# Altium schematic sheet H-bridge.SchDoc
size A4; SheetNumber: 1; SheetTotal: 2
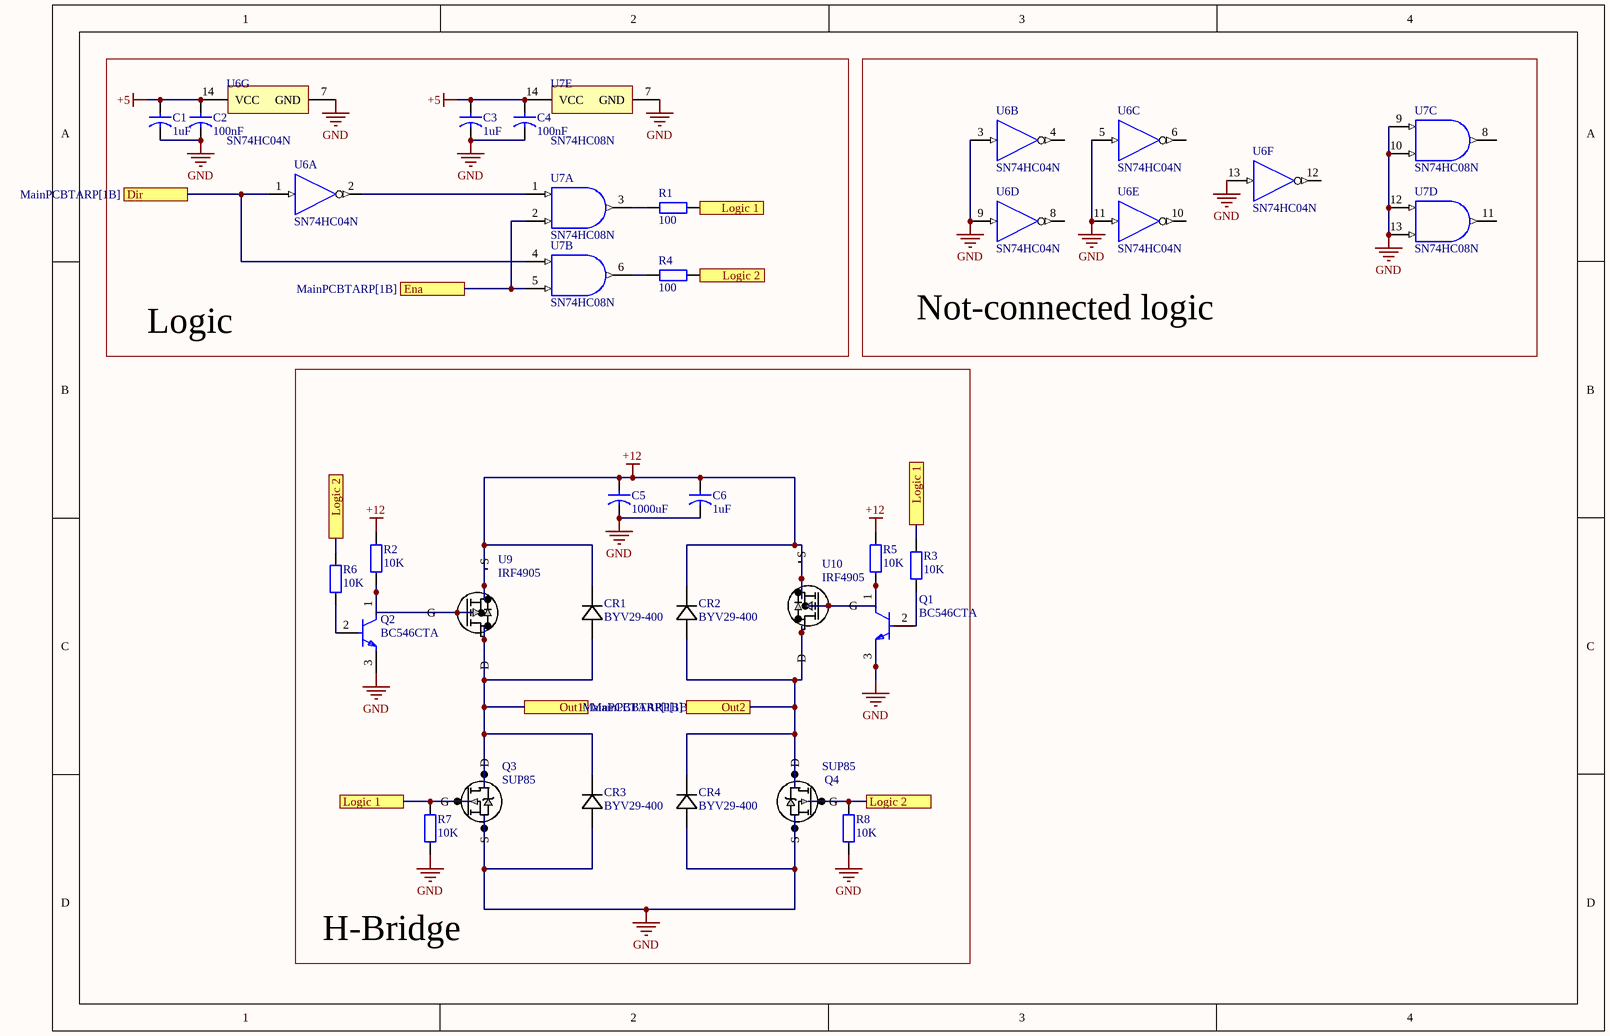
[diagram p0: H-bridge.SchDoc]

## Parts
C1  value 1uF  [Cap Lyt Ø8]  (hidden comment: Cap)
C2  value 100nF  [Cap Lyt Ø8]  (hidden comment: Cap)
C3  value 1uF  [Cap Lyt Ø8]  (hidden comment: Cap)
C4  value 100nF  [Cap Lyt Ø8]  (hidden comment: Cap)
C5  value 1000uF  [Cap Lyt Ø18]  (hidden comment: Cap)
C6  value 1uF  [Cap Lyt Ø8]  (hidden comment: Cap)
CR1  BYV29-400  [SOD59_WEN]
CR2  BYV29-400  [SOD59_WEN]
CR3  BYV29-400  [SOD59_WEN]
CR4  BYV29-400  [SOD59_WEN]
Q1  BC546CTA  [FP-135AR-MFG]
Q2  BC546CTA  [FP-135AR-MFG]
Q3  SUP85  [PG-TO251-3-901_INF]
Q4  SUP85  [PG-TO251-3-901_INF]
R1  value 100  [RES THT 9mm]  (hidden comment: Resistor)
R2  value 10K  [RES THT 9mm]  (hidden comment: Resistor)
R3  value 10K  [RES THT 9mm]  (hidden comment: Resistor)
R4  value 100  [RES THT 9mm]  (hidden comment: Resistor)
R5  value 10K  [RES THT 9mm]  (hidden comment: Resistor)
R6  value 10K  [RES THT 9mm]  (hidden comment: Resistor)
R7  value 10K  [RES THT 9mm]  (hidden comment: Resistor)
R8  value 10K  [RES THT 9mm]  (hidden comment: Resistor)
U6  SN74HC04N  [N0014A]  (parts A,B,C,D,E,F,G of 7)
U7  SN74HC08N  [N0014A]  (parts A,B,C,D,E of 5)
U9  IRF4905  [TO220AB_VIS]
U10  IRF4905  [TO220AB_VIS]

## Blocks framed on the sheet
Logic: C1-C4 R1 R4 U6 U7
Not-connected logic: U6 U7
H-Bridge: C5 C6 CR1-CR4 Q1-Q4 R2 R3 R5-R8 U9 U10

## Ports
Dir (see MainPCBTARP[1B]), Ena (see MainPCBTARP[1B]), Logic 1 (see H-bridge[1D], H-bridge[2A]), Logic 1 (see H-bridge[1D], H-bridge[3C]), Logic 1 (see H-bridge[2A], H-bridge[3C]), Logic 2 (see H-bridge[1C], H-bridge[2B]), Logic 2 (see H-bridge[1C], H-bridge[3D]), Logic 2 (see H-bridge[2B], H-bridge[3D]), Out1 (see MainPCBTARP[1B]), Out2 (see MainPCBTARP[1B])

## Nets
+5: C1.1 C2.1 C3.1 C4.1 U6.14(VCC) U7.14(VCC)
+12: C5.1 C6.1 CR1.1 CR2.1 R2.2 R5.2 U9.3(S) U10.3(S)
GND: C1.2(g) C2.2(g) C3.2(g) C4.2(g) C5.2(g) C6.2(g) CR3.2 CR4.2 Q1.3(E) Q2.3(E) Q3.3(S) Q4.3(S) R7.1 R8.1 U6.3(2A) U6.5(3A) U6.7(GND) U6.9(4A) U6.11(5A) U6.13(6A) U7.7(GND) U7.9(3A) U7.10(3B) U7.12(4A) U7.13(4B)
Dir: U6.1(1A) U7.4(2A) ; port Dir
Ena: U7.2(1B) U7.5(2B) ; port Ena
Logic 1: Q3.1(G) R1.1 R3.2 R7.2 ; port Logic 1
Logic 2: Q4.1(G) R4.2 R6.2 R8.2 ; port Logic 2
Out1: CR1.2 CR3.1 Q3.2(D) U9.2(D) ; port Out1
Out2: CR2.2 CR4.1 Q4.2(D) U10.2(D) ; port Out2
NetQ1_1: Q1.1(C) R5.1 U10.1(G)
NetQ1_2: Q1.2(B) R3.1
NetQ2_1: Q2.1(C) R2.1 U9.1(G)
NetQ2_2: Q2.2(B) R6.1
NetR1_2: R1.2 U7.3(1Y)
NetR4_1: R4.1 U7.6(2Y)
NetU6_2: U6.2(~{1Y}) U7.1(1A)

Not connected (* = marked no-connect by the designer): U6 4(~{2Y}) 6(~{3Y}) 8(~{4Y}) 10(~{5Y}) 12(~{6Y}); U7 8(3Y) 11(4Y)

## Library data of the parts
C1-C6 = Capacitor electrolytic
CR1-CR4 = BYV29-500: No Description Available; Manufacturer_Name: WeEN Semiconductors; Copyright: Copyright (C) 2025 Ultra Librarian. All rights reserved.; Manufacturer_Part_Number: BYV29-500
Q1 Q2 = CMP-00278-84408942-1: BC546CTA Small Signal Bipolar Transistor, 0.1A I(C), 65V V(BR)CEO, 1-Element, NPN, Silicon, TO-92; Manufacturer Lifecycle Status: ACTIVE; Gain Bandwidth Product: 300MHz; Emitter Base Voltage (VEBO): 6V; Element Configuration: Single; Max Power Dissipation: 500mW; Max Collector Current: 100mA; Number of Elements: 1; Collector Base Voltage (VCBO): 80V; Max Junction Temperature (Tj): 150°C; hFE Min: 110; Collector Emitter Saturation Voltage: 250mV; Lead Free: Lead Free; Max Breakdown Voltage: 65V; Collector Emitter Breakdown Voltage: 65V; Collector Emitter Voltage (VCEO): 65V; Voltage Rating (DC): 65V; Weight: 240mg; Polarity: NPN; Schedule B: 8541210080, 8541210080; Contact Plating: Tin; Lifecycle Status: Production; Mount: Through Hole; Length: 4.58mm; Number of Pins: 3; Current Rating: 100mA; Width: 3.86mm; Transition Frequency: 300MHz; Case/Package: TO-92-3; Frequency: 300MHz; Power Dissipation: 500mW; Max Operating Temperature: 150°C; Min Operating Temperature: -65°C; Max Frequency: 300MHz; Height: 4.58mm; Radiation Hardening: No; NexarPartId: 84408942; RoHS: Compliant
Q3 Q4 = IRLU024NPBF: The IR MOSFET family of power MOSFETs utilizes proven silicon processes offering designers a wide portfolio of devices to support various applications such as DC motors, inverters, SMPS, lighting, load switches as well as battery powered applications.The devices are available in a variety of surface mount and through-hole packages with industry standard footprints for ease of design.; Manufacturer_Name: Infineon; Copyright: Copyright (C) 2025 Ultra Librarian. All rights reserved.; Manufacturer_Part_Number: IRLU024NPBF; Datasheet: https://www.infineon.com/dgdl/irlr024npbf.pdf?fileId=5546d462533600a4015356694f7f265d
U6 = CMP-1615-00892-2: Hex Inverters, N0014A, TUBE; Manufacturer: Texas Instruments; VCC(Min)(V): 2; Bits(#): 6; Technology Family: HC; tpd @ Nom Voltage(Max)(ns): 20; Output Drive (IOL/IOH)(Max)(mA): -4/4; Rating: Catalog; Voltage(Nom)(V): 5; Schmitt Trigger: No; ICC @ Nom Voltage(Max)(mA): 0.02; Input Type: CMOS; Code_JEDEC: MS-001; PackageReference: N0014A; DatasheetVersion: SCLS078F; Output Type: CMOS; VCC(Max)(V): 6; Operating Temperature Range(C): -40 to 85; Generic Part Number: SN74HC04; F @ Nom Voltage(Max)(Mhz): 20
U7 = CMP-0777-00250-3: Quadruple 2-Input Positive-AND Gates, N0014A, TUBE; Manufacturer: Texas Instruments; Output Type: CMOS; ICC @ Nom Voltage(Max)(mA): 0.02; tpd @ Nom Voltage(Max)(ns): 28; Voltage(Nom)(V): 5; VCC(Min)(V): 2; Technology Family: HC; F @ Nom Voltage(Max)(Mhz): 70; Rating: Catalog; Bits(#): 4; Schmitt Trigger: No; VCC(Max)(V): 6; PackageReference: N0014A; Input Type: CMOS; Generic Part Number: SN74HC08; DatasheetVersion: SCLS081F; Operating Temperature Range(C): -40 to 85
U9 U10 = IRF9530PBF: MOSFET P-CHANNEL 100V; Manufacturer_Name: Vishay; Copyright: Copyright (C) 2025 Ultra Librarian. All rights reserved.; Manufacturer_Part_Number: IRF9530PBF